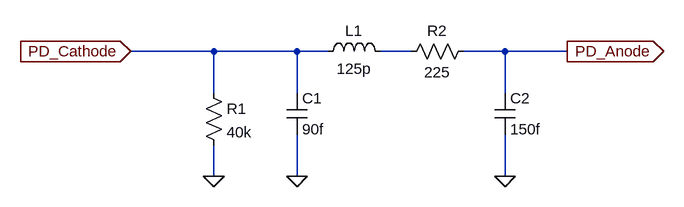
[diagram p0: schematic photodiode.asc]
photodiode.asc, the LTspice schematic file:
Version 4
SHEET 1 1476 712
WIRE 16 -32 -112 -32
WIRE 144 -32 16 -32
WIRE 192 -32 144 -32
WIRE 320 -32 272 -32
WIRE 464 -32 400 -32
WIRE 560 -32 464 -32
WIRE 16 32 16 -32
WIRE 144 32 144 -32
WIRE 464 32 464 -32
WIRE 16 160 16 112
WIRE 144 160 144 96
WIRE 464 160 464 96
FLAG 16 160 0
FLAG 144 160 0
FLAG 464 160 0
FLAG -112 -32 PD_Cathode
IOPIN -112 -32 In
FLAG 560 -32 PD_Anode
IOPIN 560 -32 Out
SYMBOL res 0 16 R0
SYMATTR InstName R1
SYMATTR Value 40k
SYMBOL cap 128 32 R0
SYMATTR InstName C1
SYMATTR Value 90f
SYMBOL cap 448 32 R0
SYMATTR InstName C2
SYMATTR Value 150f
SYMBOL ind 176 -16 R270
WINDOW 0 32 56 VTop 2
WINDOW 3 5 56 VBottom 2
SYMATTR InstName L1
SYMATTR Value 125p
SYMBOL res 416 -48 R90
WINDOW 0 0 56 VBottom 2
WINDOW 3 32 56 VTop 2
SYMATTR InstName R2
SYMATTR Value 225

The netlist it stands for:
* photodiode.asc
R1 PD_Cathode 0 40k
C1 PD_Cathode 0 90f
C2 PD_Anode 0 150f
L1 PD_Cathode N001 125p
R2 PD_Anode N001 225
.backanno
.end